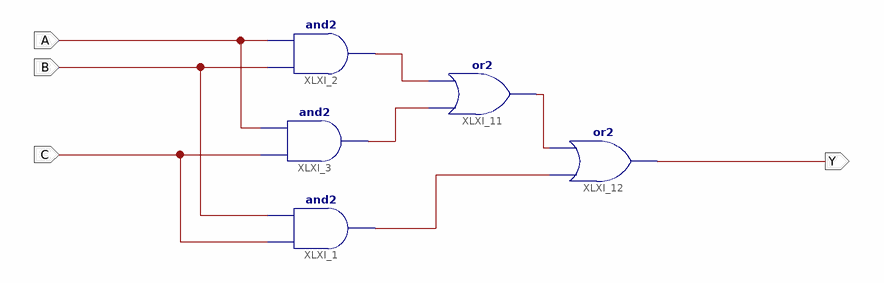
[diagram p0: schematic sheet 1]
// Xilinx ISE schematic MAJORITY.sch (spartan6) as structural Verilog: 5 symbols, 4 ports
module MAJORITY (
  input  A,
  input  B,
  input  C,
  output Y
);

  wire XLXN_36, XLXN_37, XLXN_39, XLXN_40;

  and XLXI_1 (XLXN_39, C, B);
  and XLXI_2 (XLXN_36, B, A);
  and XLXI_3 (XLXN_37, C, A);
  or XLXI_11 (XLXN_40, XLXN_37, XLXN_36);
  or XLXI_12 (Y, XLXN_39, XLXN_40);
endmodule
